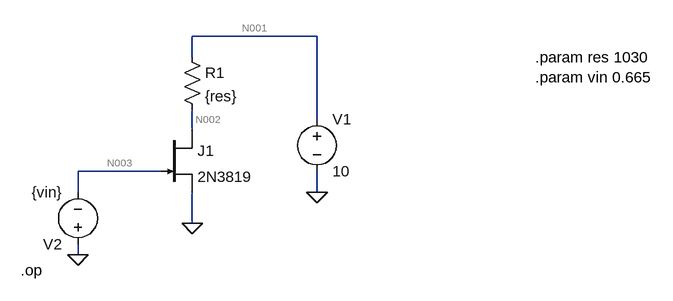
[diagram p0: schematic Draft1.asc]
Draft1.asc, the LTspice schematic file:
Version 4
SHEET 1 888 680
WIRE 352 -16 160 -16
WIRE 160 16 160 -16
WIRE 352 112 352 -16
WIRE 160 128 160 96
WIRE 112 192 -16 192
WIRE -16 224 -16 192
WIRE 352 224 352 192
WIRE 160 272 160 224
WIRE -16 320 -16 304
FLAG 160 272 0
FLAG -16 320 0
FLAG 352 224 0
SYMBOL njf 112 128 R0
SYMATTR InstName J1
SYMATTR Value 2N3819
SYMBOL res 144 0 R0
SYMATTR InstName R1
SYMATTR Value {res}
SYMBOL voltage 352 96 R0
WINDOW 123 0 0 Left 0
WINDOW 39 0 0 Left 0
SYMATTR InstName V1
SYMATTR Value 10
SYMBOL voltage -16 320 R180
WINDOW 123 0 0 Left 0
WINDOW 39 0 0 Left 0
SYMATTR InstName V2
SYMATTR Value {vin}
TEXT 688 16 Left 2 !.param res 1030\n.param vin 0.665
TEXT -104 344 Left 2 !.op

The netlist it stands for:
* Draft1.asc
J1 N002 N003 0 2N3819
R1 N001 N002 {res}
V1 N001 0 10
V2 0 N003 {vin}
.model NJF NJF
.model PJF PJF
.lib standard.jft
.param res 1030
.param vin 0.665
.op
.backanno
.end

* Results of the author's LTspice run, read from the files saved beside the schematic
* Operating Point:
*   V(n002) = 2.678 V
*   V(n003) = -665 mV
*   V(n001) = 10 V
*   Id(J1) = 7.109 mA
*   Ig(J1) = -5.012 pA
*   Is(J1) = -7.109 mA
*   I(R1) = 7.109 mA
*   I(V1) = -7.109 mA
*   I(V2) = -5.012 pA